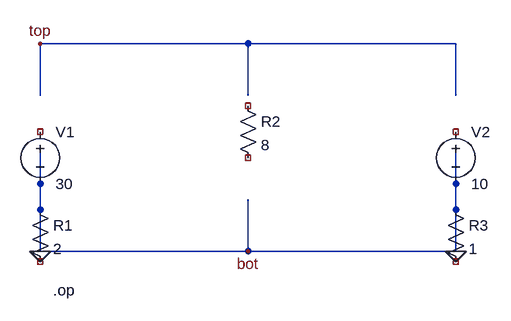
[diagram p0: schematic 02_cicuit_generated-by-claude-sonnet-4-6.asc]
02_cicuit_generated-by-claude-sonnet-4-6.asc, the LTspice schematic file:
Version 4
SHEET 1 880 680
WIRE 80 80 400 80
WIRE 400 80 720 80
WIRE 80 400 400 400
WIRE 400 400 720 400
SYMBOL voltage 80 200 R0
SYMATTR InstName V1
SYMATTR Value 30
WIRE 80 80 80 160
WIRE 80 240 80 320
SYMBOL res 64 320 R0
SYMATTR InstName R1
SYMATTR Value 2
WIRE 80 320 80 400
SYMBOL res 384 160 R0
SYMATTR InstName R2
SYMATTR Value 8
WIRE 400 80 400 160
WIRE 400 320 400 400
SYMBOL voltage 720 200 R0
SYMATTR InstName V2
SYMATTR Value 10
WIRE 720 80 720 160
WIRE 720 240 720 320
SYMBOL res 704 320 R0
SYMATTR InstName R3
SYMATTR Value 1
WIRE 720 320 720 400
FLAG 80 400 0
FLAG 400 400 bot
FLAG 720 400 0
FLAG 80 80 top
TEXT 100 460 Left 2 !.op

The netlist it stands for:
* 02_cicuit_generated-by-claude-sonnet-4-6.asc
V1 NC_01 0 30
R1 0 NC_02 2
R2 NC_03 NC_04 8
V2 NC_05 0 10
R3 0 NC_06 1
.op
.backanno
.end